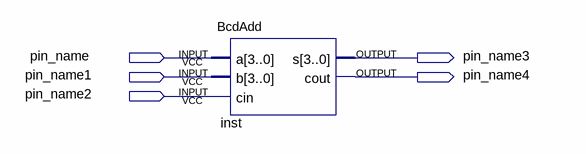
[diagram p0: schematic sheet]
// Quartus schematic BCD_Adder.bdf as structural Verilog: 1 symbols, 5 pins
module BCD_Adder (
  input  pin_name,
  input  pin_name1,
  input  pin_name2,
  output pin_name3,
  output pin_name4
);

  BcdAdd inst (.s(pin_name3), .cout(pin_name4));  // open: a, b, cin
endmodule
